# Altium project swarmbot.PrjPcb
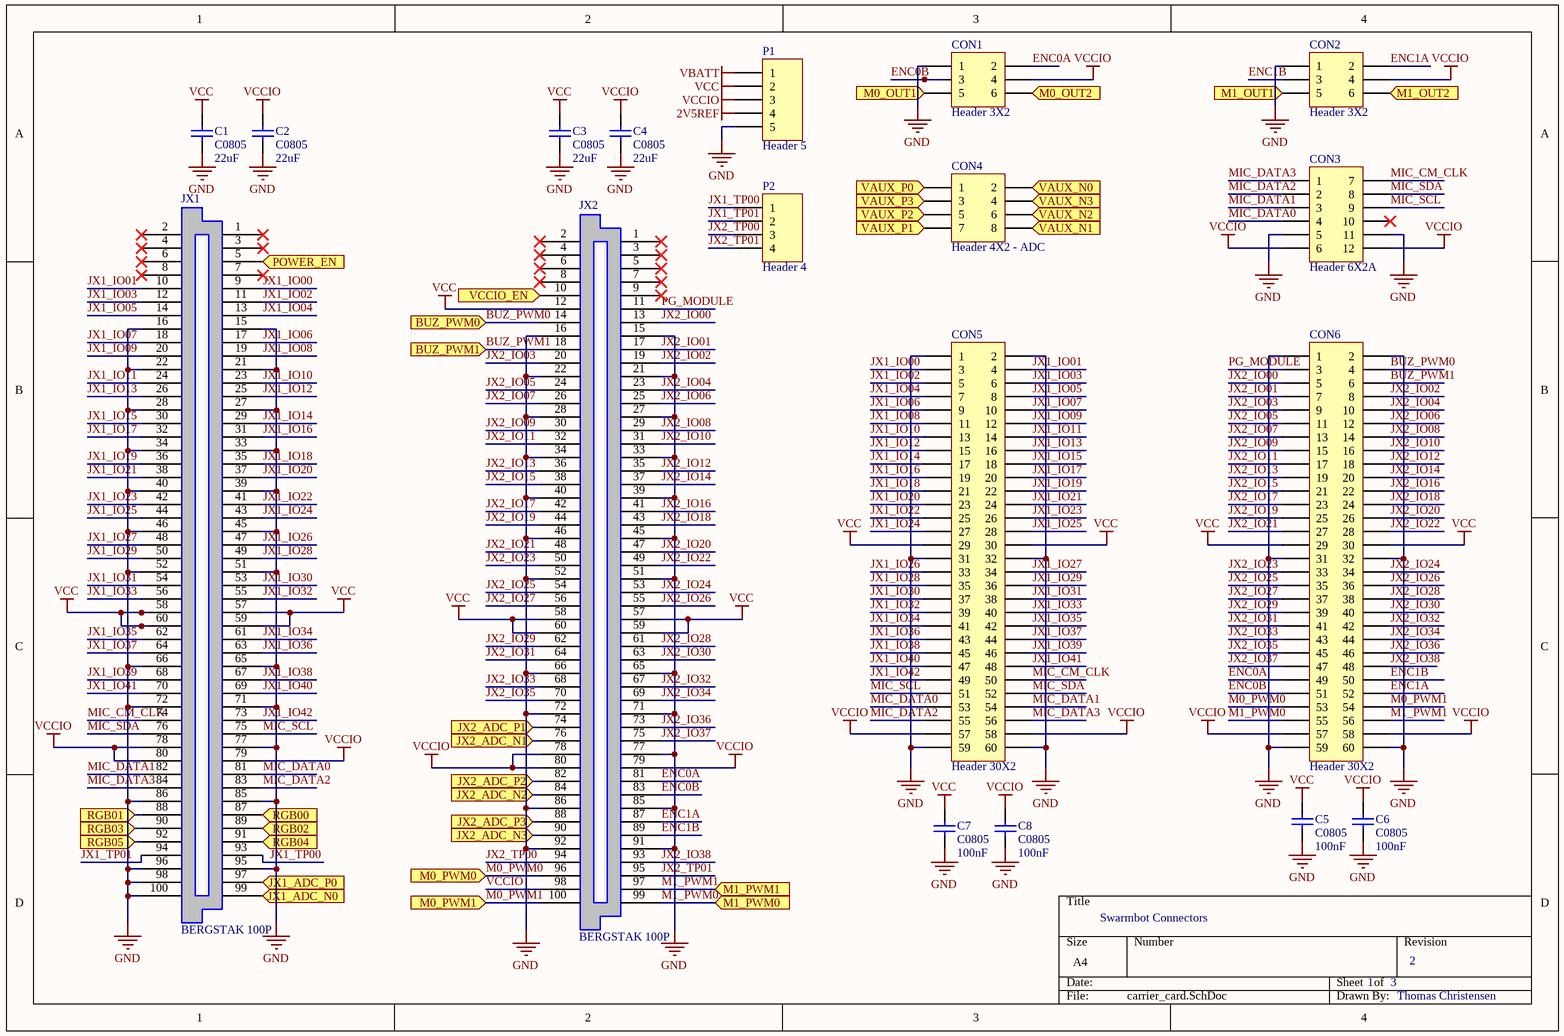
[diagram p0: carrier_card.SchDoc]
3 sheets, 96 parts. Net scope: flat (ports and power ports of the same name join across sheets).
Board file: carrier_card.PcbDoc
Sheets:
  carrier_card.SchDoc
  carrier_card_s2.SchDoc
  carrier_card_s3.SchDoc

## Sheet carrier_card.SchDoc: Swarmbot Connectors
size A4; DrawnBy: Thomas Christensen; Revision: 2; SheetNumber: 1; SheetTotal: 3

### Parts
C1  C0805  value 22uF  [0805]
C2  C0805  value 22uF  [0805]
C3  C0805  value 22uF  [0805]
C4  C0805  value 22uF  [0805]
C5  C0805  value 100nF  [0805]
C6  C0805  value 100nF  [0805]
C7  C0805  value 100nF  [0805]
C8  C0805  value 100nF  [0805]
CON1  Header 3X2  [HDR2X3]
CON2  Header 3X2  [HDR2X3]
CON3  Header 6X2A  [HDR2X6_CEN]
CON4  Header 4X2 - ADC  [HDR2X4]
CON5  Header 30X2  [HDR2X30]
CON6  Header 30X2  [HDR2X30]
JX1  BERGSTAK 100P  [FCI_BERGSTAK_100P]
JX2  BERGSTAK 100P  [FCI_BERGSTAK_100P]
P1  Header 5  [HDR1X5]
P2  Header 4  [HDR1X4]

### Ports
BUZ_PWM0, BUZ_PWM1, JX1_ADC_N0, JX1_ADC_P0, JX2_ADC_N1, JX2_ADC_N2, JX2_ADC_N3, JX2_ADC_P1, JX2_ADC_P2, JX2_ADC_P3, M0_OUT1, M0_OUT2, M0_PWM0, M0_PWM1, M1_OUT1, M1_OUT2, M1_PWM0, M1_PWM1, POWER_EN, RGB00, RGB01, RGB02, RGB03, RGB04, RGB05, VAUX_N0, VAUX_N1, VAUX_N2, VAUX_N3, VAUX_P0, VAUX_P1, VAUX_P2, VAUX_P3, VCCIO_EN

### Nets
2V5REF: P1.4
GND: C1.1 C2.1 C3.1 C4.1 C5.1 C6.1 C7.1 C8.1 CON1.1 CON2.1 CON3.5 CON3.11 CON5.1 CON5.2 CON5.31 CON5.32 CON5.59 CON5.60 CON6.1 CON6.2 CON6.31 CON6.32 CON6.59 CON6.60 JX1.15 JX1.16 JX1.21 JX1.22 JX1.27 JX1.28 JX1.33 JX1.34 JX1.39 JX1.40 JX1.45 JX1.46 JX1.51 JX1.52 JX1.65 JX1.66 JX1.71 JX1.72 JX1.77 JX1.85 JX1.86 JX1.95 JX1.96 JX1.98 JX1.100 JX2.15 JX2.16 JX2.21 JX2.22 JX2.27 JX2.28 JX2.33 JX2.34 JX2.39 JX2.40 JX2.45 JX2.46 JX2.51 JX2.52 JX2.65 JX2.66 JX2.71 JX2.72 JX2.77 JX2.85 JX2.86 JX2.91 JX2.92 P1.5
VBATT: P1.1
VCC: C1.2 C3.2 C5.2 C7.2 CON5.29 CON5.30 CON6.29 CON6.30 JX1.57 JX1.58 JX1.59 JX1.60 JX2.12 JX2.57 JX2.58 JX2.59 JX2.60 P1.2
VCCIO: C2.2 C4.2 C6.2 C8.2 CON1.4 CON2.4 CON3.6 CON3.12 CON5.57 CON5.58 CON6.57 CON6.58 JX1.78 JX1.79 JX1.80 JX2.78 JX2.79 JX2.80 JX2.98 P1.3
BUZ_PWM0: CON6.4 JX2.14 ; port BUZ_PWM0
BUZ_PWM1: CON6.6 JX2.18 ; port BUZ_PWM1
ENC0A: CON1.2 CON6.49 JX2.81
ENC0B: CON1.3 CON6.51 JX2.83
ENC1A: CON2.2 CON6.52 JX2.87
ENC1B: CON2.3 CON6.50 JX2.89
JX1_IO00: CON5.3 JX1.9
JX1_IO01: CON5.4 JX1.10
JX1_IO02: CON5.5 JX1.11
JX1_IO03: CON5.6 JX1.12
JX1_IO04: CON5.7 JX1.13
JX1_IO05: CON5.8 JX1.14
JX1_IO06: CON5.9 JX1.17
JX1_IO07: CON5.10 JX1.18
JX1_IO08: CON5.11 JX1.19
JX1_IO09: CON5.12 JX1.20
JX1_IO10: CON5.13 JX1.23
JX1_IO11: CON5.14 JX1.24
JX1_IO12: CON5.15 JX1.25
JX1_IO13: CON5.16 JX1.26
JX1_IO14: CON5.17 JX1.29
JX1_IO15: CON5.18 JX1.30
JX1_IO16: CON5.19 JX1.31
JX1_IO17: CON5.20 JX1.32
JX1_IO18: CON5.21 JX1.35
JX1_IO19: CON5.22 JX1.36
JX1_IO20: CON5.23 JX1.37
JX1_IO21: CON5.24 JX1.38
JX1_IO22: CON5.25 JX1.41
JX1_IO23: CON5.26 JX1.42
JX1_IO24: CON5.27 JX1.43
JX1_IO25: CON5.28 JX1.44
JX1_IO26: CON5.33 JX1.47
JX1_IO27: CON5.34 JX1.48
JX1_IO28: CON5.35 JX1.49
JX1_IO29: CON5.36 JX1.50
JX1_IO30: CON5.37 JX1.53
JX1_IO31: CON5.38 JX1.54
JX1_IO32: CON5.39 JX1.55
JX1_IO33: CON5.40 JX1.56
JX1_IO34: CON5.41 JX1.61
JX1_IO35: CON5.42 JX1.62
JX1_IO36: CON5.43 JX1.63
JX1_IO37: CON5.44 JX1.64
JX1_IO38: CON5.45 JX1.67
JX1_IO39: CON5.46 JX1.68
JX1_IO40: CON5.47 JX1.69
JX1_IO41: CON5.48 JX1.70
JX1_IO42: CON5.49 JX1.73
JX1_TP00: JX1.93 P2.1
JX1_TP01: JX1.94 P2.2
JX2_IO00: CON6.5 JX2.13
JX2_IO01: CON6.7 JX2.17
JX2_IO02: CON6.8 JX2.19
JX2_IO03: CON6.9 JX2.20
JX2_IO04: CON6.10 JX2.23
JX2_IO05: CON6.11 JX2.24
JX2_IO06: CON6.12 JX2.25
JX2_IO07: CON6.13 JX2.26
JX2_IO08: CON6.14 JX2.29
JX2_IO09: CON6.15 JX2.30
JX2_IO10: CON6.16 JX2.31
JX2_IO11: CON6.17 JX2.32
JX2_IO12: CON6.18 JX2.35
JX2_IO13: CON6.19 JX2.36
JX2_IO14: CON6.20 JX2.37
JX2_IO15: CON6.21 JX2.38
JX2_IO16: CON6.22 JX2.41
JX2_IO17: CON6.23 JX2.42
JX2_IO18: CON6.24 JX2.43
JX2_IO19: CON6.25 JX2.44
JX2_IO20: CON6.26 JX2.47
JX2_IO21: CON6.27 JX2.48
JX2_IO22: CON6.28 JX2.49
JX2_IO23: CON6.33 JX2.50
JX2_IO24: CON6.34 JX2.53
JX2_IO25: CON6.35 JX2.54
JX2_IO26: CON6.36 JX2.55
JX2_IO27: CON6.37 JX2.56
JX2_IO28: CON6.38 JX2.61
JX2_IO29: CON6.39 JX2.62
JX2_IO30: CON6.40 JX2.63
JX2_IO31: CON6.41 JX2.64
JX2_IO32: CON6.42 JX2.67
JX2_IO33: CON6.43 JX2.68
JX2_IO34: CON6.44 JX2.69
JX2_IO35: CON6.45 JX2.70
JX2_IO36: CON6.46 JX2.73
JX2_IO37: CON6.47 JX2.75
JX2_IO38: CON6.48 JX2.93
JX2_TP00: JX2.94 P2.3
JX2_TP01: JX2.95 P2.4
M0_PWM0: CON6.53 JX2.96 ; port M0_PWM0
M0_PWM1: CON6.54 JX2.100 ; port M0_PWM1
M1_PWM0: CON6.55 JX2.99 ; port M1_PWM0
M1_PWM1: CON6.56 JX2.97 ; port M1_PWM1
MIC_CM_CLK: CON3.7 CON5.50 JX1.74
MIC_DATA0: CON3.4 CON5.53 JX1.81
MIC_DATA1: CON3.3 CON5.54 JX1.82
MIC_DATA2: CON3.2 CON5.55 JX1.83
MIC_DATA3: CON3.1 CON5.56 JX1.84
MIC_SCL: CON3.9 CON5.51 JX1.75
MIC_SDA: CON3.8 CON5.52 JX1.76
PG_MODULE: CON6.3 JX2.11
POWER_EN: JX1.5 ; port POWER_EN
VCCIO_EN: JX2.10 ; port VCCIO_EN
NetC22_1: JX2.88 ; port JX2_ADC_P3
NetC22_2: JX2.90 ; port JX2_ADC_N3
NetC24_1: JX2.82 ; port JX2_ADC_P2
NetC24_2: JX2.84 ; port JX2_ADC_N2
NetC25_1: JX2.74 ; port JX2_ADC_P1
NetC25_2: JX2.76 ; port JX2_ADC_N1
NetC27_1: JX1.97 ; port JX1_ADC_P0
NetC27_2: JX1.99 ; port JX1_ADC_N0
NetCON1_5: CON1.5 ; port M0_OUT1
NetCON1_6: CON1.6 ; port M0_OUT2
NetCON2_5: CON2.5 ; port M1_OUT1
NetCON2_6: CON2.6 ; port M1_OUT2
NetCON4_1: CON4.1 ; port VAUX_P0
NetCON4_2: CON4.2 ; port VAUX_N0
NetCON4_3: CON4.3 ; port VAUX_P3
NetCON4_4: CON4.4 ; port VAUX_N3
NetCON4_5: CON4.5 ; port VAUX_P2
NetCON4_6: CON4.6 ; port VAUX_N2
NetCON4_7: CON4.7 ; port VAUX_P1
NetCON4_8: CON4.8 ; port VAUX_N1
NetJX1_87: JX1.87 ; port RGB00
NetJX1_88: JX1.88 ; port RGB01
NetJX1_89: JX1.89 ; port RGB02
NetJX1_90: JX1.90 ; port RGB03
NetJX1_91: JX1.91 ; port RGB04
NetJX1_92: JX1.92 ; port RGB05

Not connected (* = marked no-connect by the designer): CON3 10*; JX1 1* 2* 3* 4* 6* 7* 8*; JX2 1* 2* 3* 4* 5* 6* 7* 8* 9*

### Library data of the parts
C1-C8 = C0805: Ceramic Chip Capacitor - Standard; Note: Footprint corresponds to dimensions for bulk cassette packaging. This case size has tightened tolerances.; Published: 17-Jul-2002; LatestRevisionDate: 19-Mar-2004; LatestRevisionNote: Silkscreen size reduced.; DatasheetDocument: Mar-2001; PackageDocument: Mar-2001; PackageReference: 0805; Publisher: Altium Limited; Code_JEITA: 0805; Code_IPC: 2012[0805]; ComponentLink1Description: Manufacturer Link; ComponentLink1URL: http://www.kemet.com/; ComponentLink2Description: Datasheet; ComponentLink2URL: http://www.kemet.com/kemet/web/homepage/kechome.nsf/vapubfilesname/F3102TA.pdf/$file/F3102TA.pdf
CON1 CON2 = Header 3X2: Header, 3-Pin, Dual row; LatestRevisionDate: 17-Jul-2002; LatestRevisionNote: Re-released for DXP Platform.; Publisher: Altium Limited
CON3 = Header 6X2A: Header, 6-Pin, Dual row; LatestRevisionDate: 17-Jul-2002; LatestRevisionNote: Re-released for DXP Platform.; Publisher: Altium Limited
CON4 = Header 4X2: Header, 4-Pin, Dual row; LatestRevisionDate: 17-Jul-2002; LatestRevisionNote: Re-released for DXP Platform.; Publisher: Altium Limited
CON5 CON6 = Header 30X2: Header, 30-Pin, Dual row; LatestRevisionDate: 17-Jul-2002; LatestRevisionNote: Re-released for DXP Platform.; Publisher: Altium Limited
JX1 JX2 = BERGSTAK 100P: 100p connector, BERGSTAK
P1 = Header 5: Header, 5-Pin; LatestRevisionDate: 17-Jul-2002; LatestRevisionNote: Re-released for DXP Platform.; Publisher: Altium Limited
P2 = Header 4: Header, 4-Pin; LatestRevisionDate: 17-Jul-2002; LatestRevisionNote: Re-released for DXP Platform.; Publisher: Altium Limited

## Sheet carrier_card_s2.SchDoc: Power / Power-On/Off Sequencing
size A4; DrawnBy: Thomas Christensen; Revision: 2; SheetNumber: 2; SheetTotal: 3
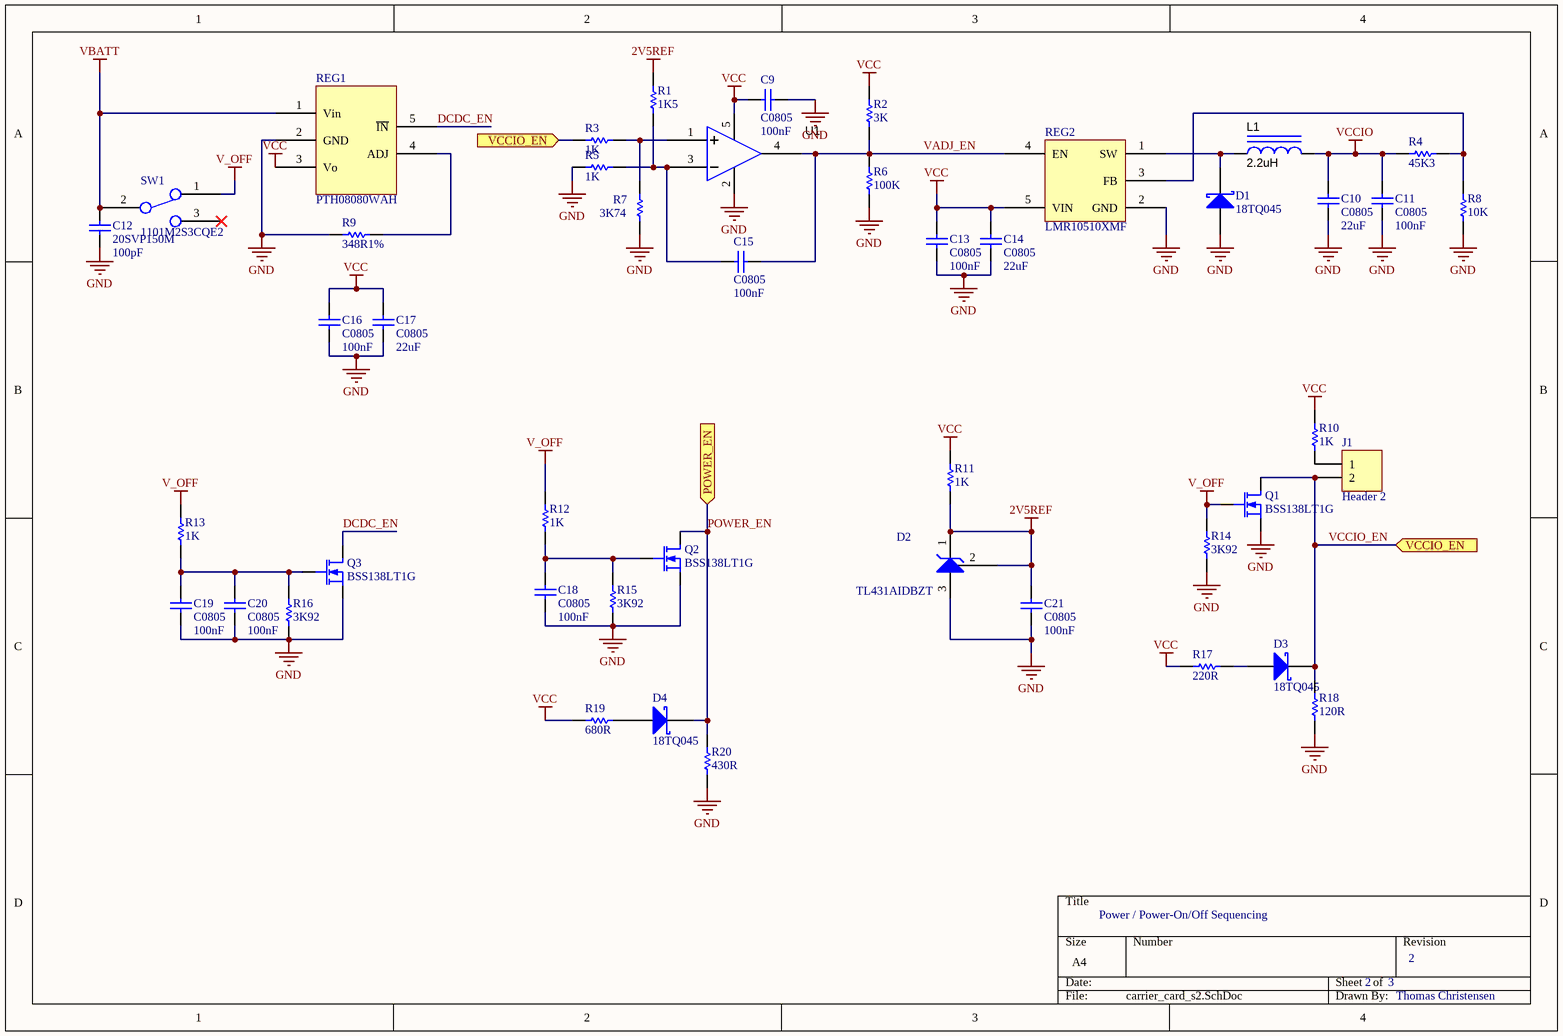
[diagram p1: carrier_card_s2.SchDoc]

### Parts
C9  C0805  value 100nF  [0805]
C10  C0805  value 22uF  [0805]
C11  C0805  value 100nF  [0805]
C12  20SVP150M  value 100pF  [20SVP150M_FP]
C13  C0805  value 100nF  [0805]
C14  C0805  value 22uF  [0805]
C15  C0805  value 100nF  [0805]
C16  C0805  value 100nF  [0805]
C17  C0805  value 22uF  [0805]
C18  C0805  value 100nF  [0805]
C19  C0805  value 100nF  [0805]
C20  C0805  value 100nF  [0805]
C21  C0805  value 100nF  [0805]
D1  18TQ045  [POWERDI-123]
D2  TL431AIDBZT  [SOT-23_N]
D3  18TQ045  [POWERDI-123]
D4  18TQ045  [POWERDI-123]
J1  Header 2  [HDR1X2]
L1  2.2uH  [SRN5020-2R2Y_FP]
Q1  BSS138LT1G  [SOT-23B]
Q2  BSS138LT1G  [SOT-23B]
Q3  BSS138LT1G  [SOT-23B]
R1  1K5  [ERA-0603]
R2  3K  [ERA-0603]
R3  1K  [ERA-0603]
R4  45K3  [ERA-0603]
R5  1K  [ERA-0603]
R6  100K  [ERA-0603]
R7  3K74  [ERA-0603]
R8  10K  [ERA-0603]
R9  348R1%  [ERA-0805]
R10  1K  [ERA-0603]
R11  1K  [ERA-0603]
R12  1K  [ERA-0603]
R13  1K  [ERA-0603]
R14  3K92  [ERA-0603]
R15  3K92  [ERA-0603]
R16  3K92  [ERA-0603]
R17  220R  [ERA-0603]
R18  120R  [ERA-0603]
R19  680R  [ERA-0603]
R20  430R  [ERA-0603]
REG1  PTH08080WAH  [PTH08080W_FP]
REG2  LMR10510XMF  [SOT23-5]
SW1  1101M2S3CQE2  [1101M2S3CQE2_FP]
U1  TLV2702  [SOT23-5]  (value not drawn)

### Ports
POWER_EN, VCCIO_EN

### Nets
2V5REF: C21.2 D2.1(K) D2.2 R1.2 R11.1
GND: C9.2 C10.1 C11.1 C12.1 C13.1 C14.1 C16.1 C17.1 C18.1 C19.1 C20.1 C21.1 D1.1(A) D2.3(A) Q1.2(S) Q2.2(S) Q3.2(S) R5.1 R6.1 R7.1 R8.1 R9.1 R14.1 R15.1 R16.1 R18.1 R20.1 REG1.2(GND) REG2.2(GND) U1.2(GND)
V_OFF: Q1.1(G) R12.2 R13.2 R14.2 SW1.1
VBATT: C12.2 REG1.1(Vin) SW1.2
VCC: C9.1 C13.2 C14.2 C16.2 C17.2 R2.2 R10.2 R11.2 R17.1 R19.1 REG1.3(Vo) REG2.5(VIN) U1.5(Vcc)
VCCIO: C10.2 C11.2 L1.2 R4.1
DCDC_EN: Q3.3(D) REG1.5(~{IN})
POWER_EN: D4.2(K) Q2.3(D) R20.2 ; port POWER_EN
VADJ_EN: C15.2 R2.1 R6.2 REG2.4(EN) U1.4(OUT)
VCCIO_EN: D3.2(K) J1.2 Q1.3(D) R3.1 R18.2 ; port VCCIO_EN
NetC15_1: C15.1 R1.1 R5.2 U1.3(IN-)
NetC18_2: C18.2 Q2.1(G) R12.1 R15.2
NetC19_2: C19.2 C20.2 Q3.1(G) R13.1 R16.2
NetD1_2: D1.2(K) L1.1 REG2.1(SW)
NetD3_1: D3.1(A) R17.2
NetD4_1: D4.1(A) R19.2
NetJ1_1: J1.1 R10.1
NetR3_2: R3.2 R7.2 U1.1(IN+)
NetR4_2: R4.2 R8.2 REG2.3(FB)
NetR9_2: R9.2 REG1.4(ADJ)

Not connected (* = marked no-connect by the designer): SW1 3*

### Library data of the parts
C9-C11 C13-C21 = C0805: as C1 on sheet carrier_card; Published: 17-Jul-2002; LatestRevisionDate: 19-Mar-2004; LatestRevisionNote: Silkscreen size reduced.; DatasheetDocument: Mar-2001; PackageDocument: Mar-2001; PackageReference: 0805; Publisher: Altium Limited; Code_JEITA: 0805; Code_IPC: 2012[0805]; ComponentLink1Description: Manufacturer Link; ComponentLink1URL: http://www.kemet.com/; ComponentLink2Description: Datasheet; ComponentLink2URL: http://www.kemet.com/kemet/web/homepage/kechome.nsf/vapubfilesname/F3102TA.pdf/$file/F3102TA.pdf
C12 = 20SVP150M: Capacitor (Semiconductor SIM Model); Published: 8-Jun-2000; LatestRevisionDate: 29-May-2009; LatestRevisionNote: IPC-7351 Footprint Added.; PackageReference: C1206; Publisher: Altium Limited; PackageDescription: Chip Capacitor
D1 D3 D4 = 18TQ045: Schottky Rectifier; Note: Terminal 2 is the TAB and is electrically connected to the cathode; Published: 8-Jun-2000; LatestRevisionDate: 17-Jul-2002; LatestRevisionNote: Re-released for DXP Platform.; DatasheetVersion: Dec-1997; PackageVersion: Feb-1998; PackageReference: TO-220AC; Publisher: Altium Limited; PackageDescription: TO, Thru-Hole, Vertical, Heatsink Mounted; 3 In-Line Leads (1 Absent); Pitch 2.54 mm; ComponentLink1Description: Manufacturer Link; ComponentLink1URL: http://www.irf.com/; ComponentLink2Description: Datasheet; ComponentLink2URL: http://www.irf.com/product-info/datasheets/data/18tq.pdf
D2 = TL431AIDBZT: Variable voltage  reference; Note: Pin 2 is not connected and not drawn.; Published: 21-Mar-2003; LatestRevisionDate: 29-May-2009; LatestRevisionNote: IPC-7351 Footprint Added.; DatasheetVersion: Oct-1999; PackageVersion: Sep-2001; PackageReference: SOT-23; Publisher: Altium Limited; PackageDescription: 3-Pin SOT-23 Package 0.95 mm Pitch, 2.5 mm Lead Span; ComponentLink1Description: Manufacturer Link; ComponentLink1URL: http://www.infineon.com/; ComponentLink2Description: Datasheet; ComponentLink2URL: http://www.infineon.com/upload/Document/cmc_upload/documents/012/5331/bas16series.pdf
J1 = Header 2: Header, 2-Pin; LatestRevisionDate: 17-Jul-2002; LatestRevisionNote: Re-released for DXP Platform.; Publisher: Altium Limited
L1 = SRN5020-2R2Y: Manufacturer 1: Cooper Bussmann; Manufacturer Part Number 1: DR73-100-R; Ratings: 2.1 A; Tolerance: ±20%; Material: ferrite shielded; SCDType: spec; Package / Case: 5.0x5.0x4.5mm; Supplier 1: Digi-Key; Supplier Part Number 1: 513-1129-1-ND; ComponentLink1URL: http://www.cooperindustries.com/content/dam/public/bussmann/Electronics/Resources/Data%20Sheets/Bus_Elx_DS_4315_DR_Series.pdf; ComponentLink1Description: http://www.cooperindustries.com/content/dam/public/bussmann/Electronics/Resources/Data%20Sheets/Bus_Elx_DS_4315_DR_Series.pdf; Value: 2.2uH
Q1-Q3 = BSS138LT1G: N-Channel MOSFET; Published: 8-Jun-2000; LatestRevisionDate: 17-Jul-2002; LatestRevisionNote: Re-released for DXP Platform.; PackageVersion: 1995/1996; PackageReference: E3; Publisher: Altium Limited; PackageDescription: TO, Flat Index; 3 In-Line, Axial Leads; Body Dia. 4.6mm; Lead Dia. 0.5 mm (max)
R1-R8 R10-R20 = ERA3Y: Rectangular Thick Film Chip Resistor, 10 Ohm to 330k Ohm Range, 0.1% and 0.5% Tolerance, 0603 Size, 0.063 W; Note: If flow soldering, adjust pad width of PCB Footprint to 0.7 - 0.8 times the width of the resistor.; Published: 17-Dec-2003; LatestRevisionDate: 19-Mar-2004; LatestRevisionNote: Silkscreen size reduced.; PackageDocument: Mar-2003; PackageReference: ERA-0603; Publisher: Altium Limited; Code_IPC: 1608 [0603]; ComponentLink1Description: Manufacturer Link; ComponentLink1URL: http://www.panasonic.com/industrial/components/resistive_products.htm; ComponentLink2Description: Datasheet; ComponentLink2URL: http://www.panasonic.com/industrial/components/pdf/AOA0000CE8.pdf
R9 = ERA6Y: Rectangular Thick Film Chip Resistor, 10 Ohm to 1M Ohm Range, 0.1% and 0.5% Tolerance, 0805 Size, 0.1 W; Note: If flow soldering, adjust pad width of PCB Footprint to 0.7 - 0.8 times the width of the resistor.; Published: 17-Dec-2003; LatestRevisionDate: 19-Mar-2004; LatestRevisionNote: Silkscreen size reduced.; PackageDocument: Mar-2003; PackageReference: ERA-0805; Publisher: Altium Limited; Code_IPC: 2012 [0805]; ComponentLink1Description: Manufacturer Link; ComponentLink1URL: http://www.panasonic.com/industrial/components/resistive_products.htm; ComponentLink2Description: Datasheet; ComponentLink2URL: http://www.panasonic.com/industrial/components/pdf/AOA0000CE8.pdf
U1 = LMV331QDBVRQ1: IC SMD AMP+COMPAR Combo SOIC-8; Manufacturer 1: Texas Instruments; Manufacturer Part Number 1: TLV2702ID; Voltage - Supply: 2.7 V ~ 16 V, ±1.35 V ~ 8 V; SCDType: undef; Package / Case: 8-SOIC (0.154", 3.90mm Width); Supplier 1: Digi-Key; Supplier Part Number 1: 296-12503-5-ND

## Sheet carrier_card_s3.SchDoc: Debug LEDs / Anti-Aliasing / Motor Drivers
size A4; DrawnBy: Thomas Christensen; Revision: 2; SheetNumber: 3; SheetTotal: 3
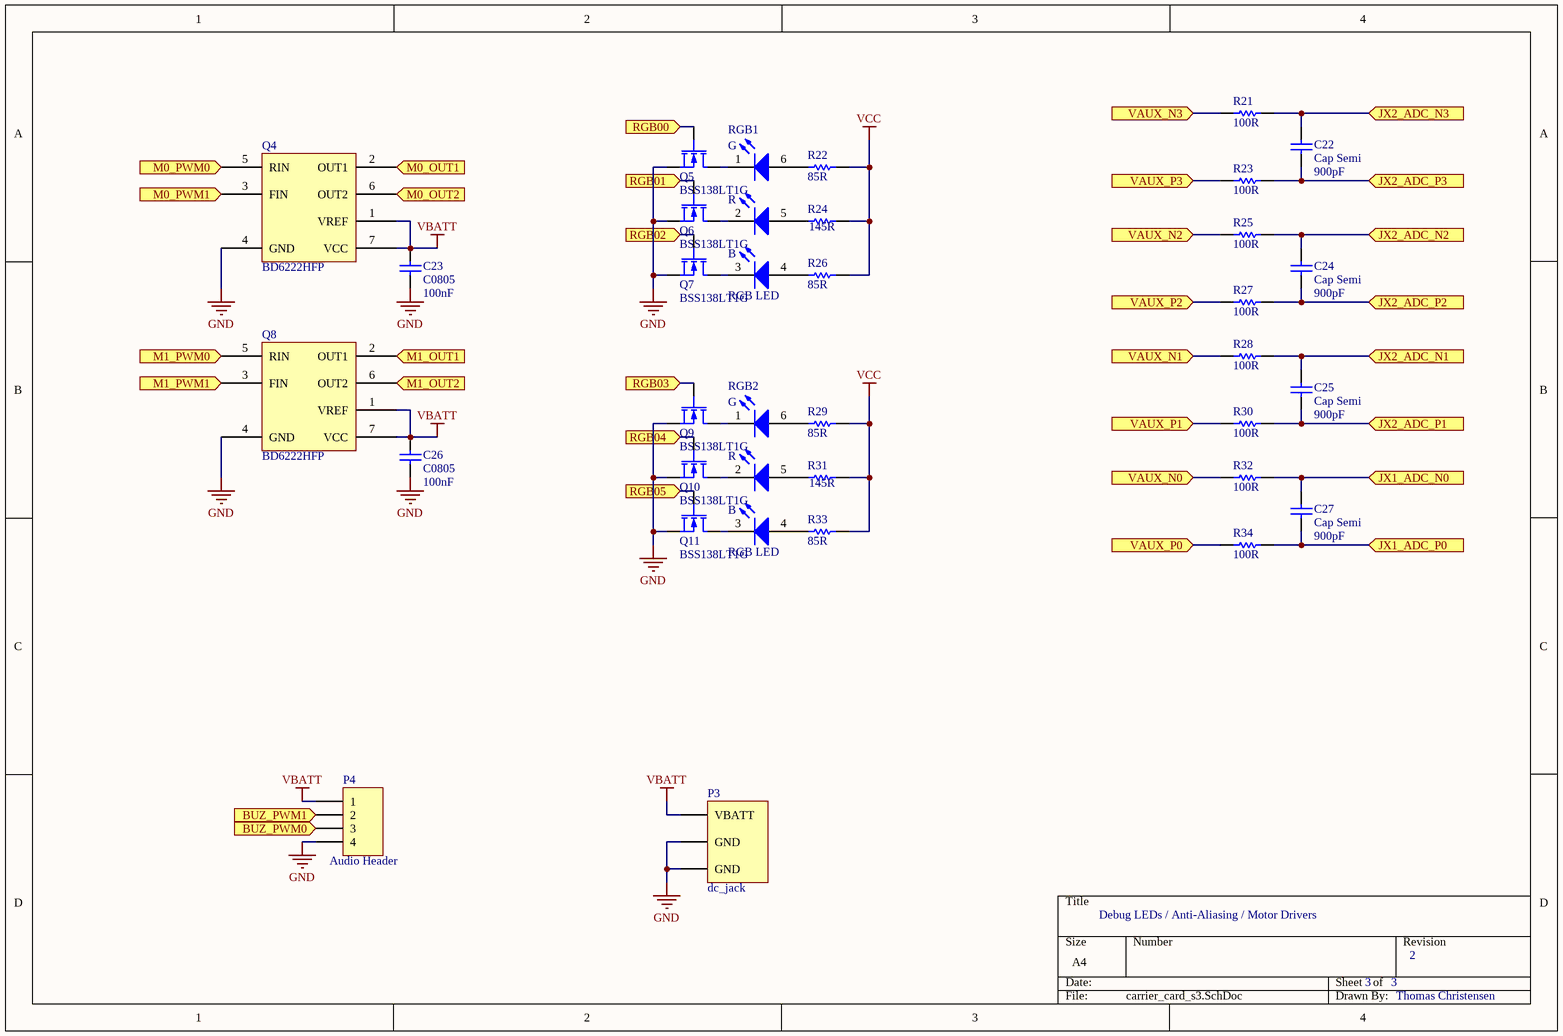
[diagram p2: carrier_card_s3.SchDoc]

### Parts
C22  Cap Semi  value 900pF  [0402]
C23  C0805  value 100nF  [0805]
C24  Cap Semi  value 900pF  [0402]
C25  Cap Semi  value 900pF  [0402]
C26  C0805  value 100nF  [0805]
C27  Cap Semi  value 900pF  [0402]
P3  dc_jack  [Power Jack]
P4  Audio Header  [HDR1X4]
Q4  BD6222HFP  [HRP7_N]
Q5  BSS138LT1G  [SOT-23B]
Q6  BSS138LT1G  [SOT-23B]
Q7  BSS138LT1G  [SOT-23B]
Q8  BD6222HFP  [HRP7_N]
Q9  BSS138LT1G  [SOT-23B]
Q10  BSS138LT1G  [SOT-23B]
Q11  BSS138LT1G  [SOT-23B]
R21  100R  [2-0402]
R22  85R  [ERA-0603]
R23  100R  [2-0402]
R24  145R  [ERA-0603]
R25  100R  [2-0402]
R26  85R  [ERA-0603]
R27  100R  [2-0402]
R28  100R  [2-0402]
R29  85R  [ERA-0603]
R30  100R  [2-0402]
R31  145R  [ERA-0603]
R32  100R  [2-0402]
R33  85R  [ERA-0603]
R34  100R  [2-0402]
RGB1  RGB LED  [RGB_LED]
RGB2  RGB LED  [RGB_LED]

### Ports
BUZ_PWM0, BUZ_PWM1, JX1_ADC_N0, JX1_ADC_P0, JX2_ADC_N1, JX2_ADC_N2, JX2_ADC_N3, JX2_ADC_P1, JX2_ADC_P2, JX2_ADC_P3, M0_OUT1, M0_OUT2, M0_PWM0, M0_PWM1, M1_OUT1, M1_OUT2, M1_PWM0, M1_PWM1, RGB00, RGB01, RGB02, RGB03, RGB04, RGB05, VAUX_N0, VAUX_N1, VAUX_N2, VAUX_N3, VAUX_P0, VAUX_P1, VAUX_P2, VAUX_P3

### Nets
GND: C23.1 C26.1 P3.2(GND) P3.3(GND) P4.4 Q4.4(GND) Q5.2(S) Q6.2(S) Q7.2(S) Q8.4(GND) Q9.2(S) Q10.2(S) Q11.2(S)
VBATT: C23.2 C26.2 P3.1(VBATT) P4.1 Q4.1(VREF) Q4.7(VCC) Q8.1(VREF) Q8.7(VCC)
VCC: R22.2 R24.2 R26.2 R29.2 R31.2 R33.2
BUZ_PWM0: P4.3 ; port BUZ_PWM0
BUZ_PWM1: P4.2 ; port BUZ_PWM1
M0_PWM0: Q4.5(RIN) ; port M0_PWM0
M0_PWM1: Q4.3(FIN) ; port M0_PWM1
M1_PWM0: Q8.5(RIN) ; port M1_PWM0
M1_PWM1: Q8.3(FIN) ; port M1_PWM1
NetC22_1: C22.1 R23.2 ; port JX2_ADC_P3
NetC22_2: C22.2 R21.2 ; port JX2_ADC_N3
NetC24_1: C24.1 R27.2 ; port JX2_ADC_P2
NetC24_2: C24.2 R25.2 ; port JX2_ADC_N2
NetC25_1: C25.1 R30.2 ; port JX2_ADC_P1
NetC25_2: C25.2 R28.2 ; port JX2_ADC_N1
NetC27_1: C27.1 R34.2 ; port JX1_ADC_P0
NetC27_2: C27.2 R32.2 ; port JX1_ADC_N0
NetCON1_5: Q4.2(OUT1) ; port M0_OUT1
NetCON1_6: Q4.6(OUT2) ; port M0_OUT2
NetCON2_5: Q8.2(OUT1) ; port M1_OUT1
NetCON2_6: Q8.6(OUT2) ; port M1_OUT2
NetCON4_1: R34.1 ; port VAUX_P0
NetCON4_2: R32.1 ; port VAUX_N0
NetCON4_3: R23.1 ; port VAUX_P3
NetCON4_4: R21.1 ; port VAUX_N3
NetCON4_5: R27.1 ; port VAUX_P2
NetCON4_6: R25.1 ; port VAUX_N2
NetCON4_7: R30.1 ; port VAUX_P1
NetCON4_8: R28.1 ; port VAUX_N1
NetJX1_87: Q5.1(G) ; port RGB00
NetJX1_88: Q6.1(G) ; port RGB01
NetJX1_89: Q7.1(G) ; port RGB02
NetJX1_90: Q9.1(G) ; port RGB03
NetJX1_91: Q10.1(G) ; port RGB04
NetJX1_92: Q11.1(G) ; port RGB05
NetQ5_3: Q5.3(D) RGB1.1
NetQ6_3: Q6.3(D) RGB1.2
NetQ7_3: Q7.3(D) RGB1.3
NetQ9_3: Q9.3(D) RGB2.1
NetQ10_3: Q10.3(D) RGB2.2
NetQ11_3: Q11.3(D) RGB2.3
NetR22_1: R22.1 RGB1.6
NetR24_1: R24.1 RGB1.5
NetR26_1: R26.1 RGB1.4
NetR29_1: R29.1 RGB2.6
NetR31_1: R31.1 RGB2.5
NetR33_1: R33.1 RGB2.4

### Notes on the sheet
- (in symbol LTRB R8SF) G; R; B

### Library data of the parts
C22 C24 C25 C27 = Cap Semi: Capacitor (Semiconductor SIM Model); Published: 8-Jun-2000; LatestRevisionDate: 29-May-2009; LatestRevisionNote: IPC-7351 Footprint Added.; PackageReference: C1206; Publisher: Altium Limited; PackageDescription: Chip Capacitor
C23 C26 = C0805: as C1 on sheet carrier_card; Published: 17-Jul-2002; LatestRevisionDate: 19-Mar-2004; LatestRevisionNote: Silkscreen size reduced.; DatasheetDocument: Mar-2001; PackageDocument: Mar-2001; PackageReference: 0805; Publisher: Altium Limited; Code_JEITA: 0805; Code_IPC: 2012[0805]; ComponentLink1Description: Manufacturer Link; ComponentLink1URL: http://www.kemet.com/; ComponentLink2Description: Datasheet; ComponentLink2URL: http://www.kemet.com/kemet/web/homepage/kechome.nsf/vapubfilesname/F3102TA.pdf/$file/F3102TA.pdf
P4 = Header 4: Header, 4-Pin; LatestRevisionDate: 17-Jul-2002; LatestRevisionNote: Re-released for DXP Platform.; Publisher: Altium Limited
Q5-Q7 Q9-Q11 = BSS138LT1G: N-Channel MOSFET; Published: 8-Jun-2000; LatestRevisionDate: 17-Jul-2002; LatestRevisionNote: Re-released for DXP Platform.; PackageVersion: 1995/1996; PackageReference: E3; Publisher: Altium Limited; PackageDescription: TO, Flat Index; 3 In-Line, Axial Leads; Body Dia. 4.6mm; Lead Dia. 0.5 mm (max)
R21 R23 R25 R27 R28 R30 R32 R34 = ERJ2GE: Thick Film Chip Resistor, 1 Ohm to 2.2M Ohm Range, 5% Tolerance, 0402 Size, 0.063 W; Note: If flow soldering, adjust pad width of PCB Footprint to 0.7 - 0.8 times the width of the resistor.; Published: 17-Dec-2003; LatestRevisionDate: 19-Mar-2004; LatestRevisionNote: Silkscreen size reduced.; PackageDocument: Mar-2003; PackageReference: 2-0402; Publisher: Altium Limited; Code_IPC: 1005 [0402]; ComponentLink1Description: Manufacturer Link; ComponentLink1URL: http://www.panasonic.com/industrial/components/resistive_products.htm; ComponentLink2Description: Datasheet; ComponentLink2URL: http://www.panasonic.com/industrial/components/pdf/AOA0000CE1.pdf
R22 R24 R26 R29 R31 R33 = ERA3Y: as R1 on sheet carrier_card_s2; Published: 17-Dec-2003; LatestRevisionDate: 19-Mar-2004; LatestRevisionNote: Silkscreen size reduced.; PackageDocument: Mar-2003; PackageReference: ERA-0603; Publisher: Altium Limited; Code_IPC: 1608 [0603]; ComponentLink1Description: Manufacturer Link; ComponentLink1URL: http://www.panasonic.com/industrial/components/resistive_products.htm; ComponentLink2Description: Datasheet; ComponentLink2URL: http://www.panasonic.com/industrial/components/pdf/AOA0000CE8.pdf
RGB1 RGB2 = LTRB R8SF

## Nets that join several sheets
2V5REF: carrier_card (P1.4), carrier_card_s2 (5 pins)
GND: carrier_card (73 pins), carrier_card_s2 (30 pins), carrier_card_s3 (13 pins)
VBATT: carrier_card (P1.1), carrier_card_s2 (C12.2 REG1.1 SW1.2), carrier_card_s3 (8 pins)
VCC: carrier_card (18 pins), carrier_card_s2 (13 pins), carrier_card_s3 (6 pins)
VCCIO: carrier_card (20 pins), carrier_card_s2 (C10.2 C11.2 L1.2 R4.1)
BUZ_PWM0: carrier_card (CON6.4 JX2.14), carrier_card_s3 (P4.3)
BUZ_PWM1: carrier_card (CON6.6 JX2.18), carrier_card_s3 (P4.2)
M0_PWM0: carrier_card (CON6.53 JX2.96), carrier_card_s3 (Q4.5)
M0_PWM1: carrier_card (CON6.54 JX2.100), carrier_card_s3 (Q4.3)
M1_PWM0: carrier_card (CON6.55 JX2.99), carrier_card_s3 (Q8.5)
M1_PWM1: carrier_card (CON6.56 JX2.97), carrier_card_s3 (Q8.3)
NetC22_1: carrier_card (JX2.88), carrier_card_s3 (C22.1 R23.2)
NetC22_2: carrier_card (JX2.90), carrier_card_s3 (C22.2 R21.2)
NetC24_1: carrier_card (JX2.82), carrier_card_s3 (C24.1 R27.2)
NetC24_2: carrier_card (JX2.84), carrier_card_s3 (C24.2 R25.2)
NetC25_1: carrier_card (JX2.74), carrier_card_s3 (C25.1 R30.2)
NetC25_2: carrier_card (JX2.76), carrier_card_s3 (C25.2 R28.2)
NetC27_1: carrier_card (JX1.97), carrier_card_s3 (C27.1 R34.2)
NetC27_2: carrier_card (JX1.99), carrier_card_s3 (C27.2 R32.2)
NetCON1_5: carrier_card (CON1.5), carrier_card_s3 (Q4.2)
NetCON1_6: carrier_card (CON1.6), carrier_card_s3 (Q4.6)
NetCON2_5: carrier_card (CON2.5), carrier_card_s3 (Q8.2)
NetCON2_6: carrier_card (CON2.6), carrier_card_s3 (Q8.6)
NetCON4_1: carrier_card (CON4.1), carrier_card_s3 (R34.1)
NetCON4_2: carrier_card (CON4.2), carrier_card_s3 (R32.1)
NetCON4_3: carrier_card (CON4.3), carrier_card_s3 (R23.1)
NetCON4_4: carrier_card (CON4.4), carrier_card_s3 (R21.1)
NetCON4_5: carrier_card (CON4.5), carrier_card_s3 (R27.1)
NetCON4_6: carrier_card (CON4.6), carrier_card_s3 (R25.1)
NetCON4_7: carrier_card (CON4.7), carrier_card_s3 (R30.1)
NetCON4_8: carrier_card (CON4.8), carrier_card_s3 (R28.1)
NetJX1_87: carrier_card (JX1.87), carrier_card_s3 (Q5.1)
NetJX1_88: carrier_card (JX1.88), carrier_card_s3 (Q6.1)
NetJX1_89: carrier_card (JX1.89), carrier_card_s3 (Q7.1)
NetJX1_90: carrier_card (JX1.90), carrier_card_s3 (Q9.1)
NetJX1_91: carrier_card (JX1.91), carrier_card_s3 (Q10.1)
NetJX1_92: carrier_card (JX1.92), carrier_card_s3 (Q11.1)
POWER_EN: carrier_card (JX1.5), carrier_card_s2 (D4.2 Q2.3 R20.2)
VCCIO_EN: carrier_card (JX2.10), carrier_card_s2 (5 pins)